# EAGLE schematic main1 (EAGLE 7.5.0)
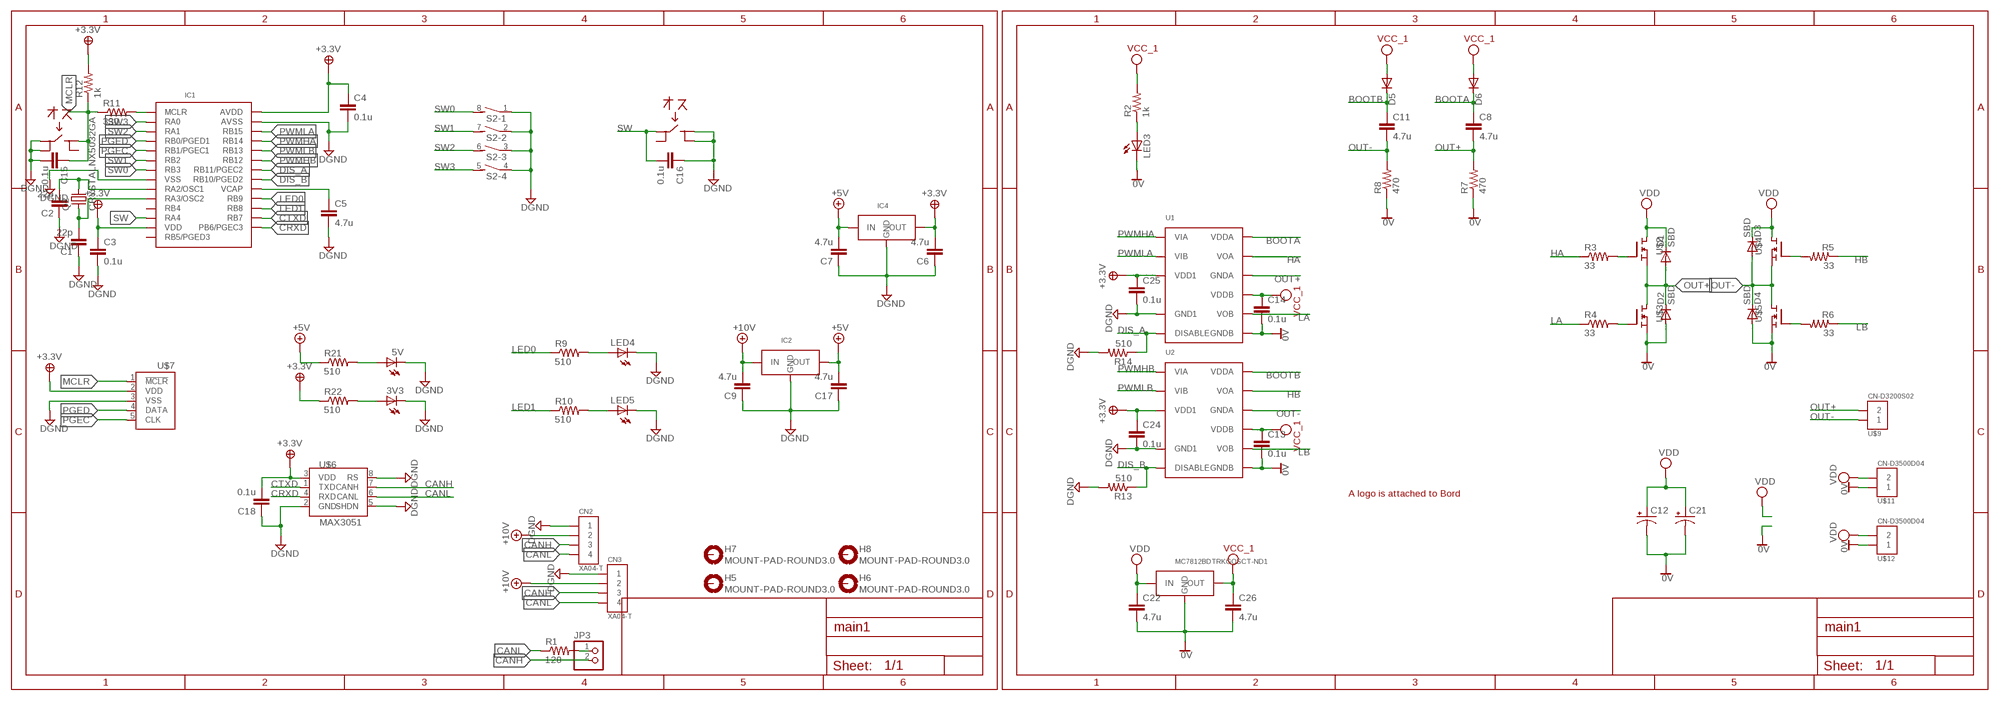
[diagram p0: schematic, sheet 1]

## Parts
3V3  LEDCHIPLED_0805  [CHIPLED_0805]
5V  LEDCHIPLED_0805  [CHIPLED_0805]
C1  22p  C-EUC0603K  [C0603K]
C2  22p  C-EUC0603K  [C0603K]
C3  0.1u  C-EUC0805K  [C0805K]
C4  0.1u  C-EUC0805K  [C0805K]
C5  4.7u  C-EUC0805K  [C0805K]
C6  4.7u  C-EUC0805K  [C0805K]
C7  4.7u  C-EUC0805K  [C0805K]
C8  4.7u  C-EUC0805K  [C0805K]
C9  4.7u  C-EUC0805K  [C0805K]
C11  4.7u  C-EUC0805K  [C0805K]
C12  CPOL-USG  [PANASONIC_G]
C13  0.1u  C-EUC0805K  [C0805K]
C14  0.1u  C-EUC0805K  [C0805K]
C15  0.1u  C-EUC0603K  [C0603K]
C16  0.1u  C-EUC0603K  [C0603K]
C17  4.7u  C-EUC0805K  [C0805K]
C18  0.1u  C-EUC0603K  [C0603K]
C21  CPOL-USG  [PANASONIC_G]
C22  4.7u  C-EUC0805K  [C0805K]
C24  0.1u  C-EUC0805K  [C0805K]
C25  0.1u  C-EUC0805K  [C0805K]
C26  4.7u  C-EUC0805K  [C0805K]
CN2  XA04-T  [XA04]
CN3  XA04-T  [XA04]
D1  SBD  DIODE-SOD106-R  [SOD106-R]
D2  SBD  DIODE-SOD106-R  [SOD106-R]
D3  SBD  DIODE-SOD106-R  [SOD106-R]
D4  SBD  DIODE-SOD106-R  [SOD106-R]
D5  DIODE-SOD106-R  [SOD106-R]
D6  DIODE-SOD106-R  [SOD106-R]
H5  MOUNT-PAD-ROUND3.0  [3,0-PAD]
H6  MOUNT-PAD-ROUND3.0  [3,0-PAD]
H7  MOUNT-PAD-ROUND3.0  [3,0-PAD]
H8  MOUNT-PAD-ROUND3.0  [3,0-PAD]
IC1  DSPIC33FJ32MC302/64MC202/64MC802/128MC202/128MC802  [SOIC28]
IC2  REGULATERNJM2845DL1  [TO-252-2]
IC4  REGULATERAZ1117CR  [SOT89]
JP3  PINHD-1X02_2.54  [1X02]
LED3  LEDCHIPLED_0805  [CHIPLED_0805]
LED4  LEDCHIPLED_0805  [CHIPLED_0805]
LED5  LEDCHIPLED_0805  [CHIPLED_0805]
MC7812BDTRKGOSCT-ND1  REGULATERMIC2940A-5.0WU  [TO-263-3]
Q2  CRYSTALNX5032GA  [NX5032GA]
R1  120  R-US_R0805  [R0805]
R2  1k  R-US_R0603  [R0603]
R3  33  R-US_R2512  [R2512]
R4  33  R-US_R2512  [R2512]
R5  33  R-US_R2512  [R2512]
R6  33  R-US_R2512  [R2512]
R7  470  R-US_R2512  [R2512]
R8  470  R-US_R2512  [R2512]
R9  510  R-US_R0603  [R0603]
R10  510  R-US_R0603  [R0603]
R11  330  R-US_R0603  [R0603]
R12  1k  R-US_R0603  [R0603]
R13  510  R-US_R0603  [R0603]
R14  510  R-US_R0603  [R0603]
R21  510  R-US_R0603  [R0603]
R22  510  R-US_R0603  [R0603]
S2  DIP04S  [DIP04S]
SW1  SWITCH_4PALPS  [SKRP]
SW2  SWITCH_4PALPS  [SKRP]
U1  ADUM3223_SMD  [SOIC16_N]
U2  ADUM3223_SMD  [SOIC16_N]
U$1  CN-D3500D04  [D-3500D04]
U$2  FET_NCHFDBL0065N40  [MO-299A]
U$3  FET_NCHFDBL0065N40  [MO-299A]
U$4  FET_NCHFDBL0065N40  [MO-299A]
U$5  FET_NCHFDBL0065N40  [MO-299A]
U$6  MAX3051  [SOIC8]
U$7  WRITE_FOR_PICT  [ZH05]
U$8  LOGOGOCHIUSA-14MM  [LOGO006]
U$9  CN-D3200S02  [D-3200S02-S]

## Nets
0V: C12.- C13.2 C14.2 C21.- C22.2 C26.2 D2.A D4.A LED3.C MC7812BDTRKGOSCT-ND1.2(GND) MC7812BDTRKGOSCT-ND1.4(GND) R7.1 R8.1 U1.P$9(GNDB) U2.P$9(GNDB) U$1.01A U$1.02A U$3.2(S) U$3.3(S) U$3.4(S) U$3.5(S) U$3.6(S) U$3.7(S) U$3.8(S) U$5.2(S) U$5.3(S) U$5.4(S) U$5.5(S) U$5.6(S) U$5.7(S) U$5.8(S)
3.3V: C3.1 C4.1 C6.2 C18.2 C24.1 C25.1 IC1.13(VDD) IC1.28(AVDD) IC4.2(OUT) IC4.P(OUT) R12.2 R22.1 U1.P$3(VDD1) U1.P$8(VDD1) U2.P$3(VDD1) U2.P$8(VDD1) U$6.3(VDD) U$7.2(VDD) ; supply symbol labelled +3.3V
+5V: C7.2 C17.2 IC2.3(OUT) IC4.3(IN) R21.1
+10V: C9.2 CN2.PIN2 CN3.PIN2 IC2.1(IN)
BOOTA: C8.1 D6.C U1.P$16(VDDA)
BOOTB: C11.1 D5.C U2.P$16(VDDA)
CANH: CN2.PIN3 CN3.PIN3 JP3.2 U$6.7(CANH)
CANL: CN2.PIN4 CN3.PIN4 R1.1 U$6.6(CANL)
CRXD: IC1.15(PB6/PGEC3) U$6.4(RXD)
CTXD: IC1.16(RB7) U$6.1(TXD)
DGND: 3V3.C 5V.C C1.1 C2.1 C3.2 C4.2 C5.2 C6.1 C7.1 C9.1 C15.2 C16.1 C17.1 C18.1 C24.2 C25.2 CN2.PIN1 CN3.PIN1 IC1.8(VSS) IC1.19(VSS) IC1.27(AVSS) IC2.2(GND) IC4.1(GND) LED4.C LED5.C R13.2 R14.2 S2.1 S2.2 S2.3 S2.4 SW1.1 SW1.2 SW2.3 SW2.4 U1.P$4(GND1) U2.P$4(GND1) U$6.2(GND) U$6.5(SHDN) U$6.8(RS) U$7.3(VSS)
DIS_A: IC1.22(RB11/PGEC2) R14.1 U1.P$5(DISABLE)
DIS_B: IC1.21(RB10/PGED2) R13.1 U2.P$5(DISABLE)
HA: R3.1 U1.P$15(VOA)
HB: R5.1 U2.P$15(VOA)
LA: R4.1 U1.P$10(VOB)
LB: R6.1 U2.P$10(VOB)
LED0: IC1.18(RB9) R9.1
LED1: IC1.17(RB8) R10.1
MCLR: C15.1 R11.1 R12.1 SW1.3 U$7.1(!MCLR)
N$1: C2.2 IC1.9(RA2/OSC1) Q2.2
N$2: C1.2 IC1.10(RA3/OSC2) Q2.1
N$3: C5.1 IC1.20(VCAP)
N$4: JP3.1 R1.2
N$5: LED3.A R2.1
N$6: LED4.A R9.2
N$7: LED5.A R10.2
N$8: R3.2 U$2.1(G)
N$9: R4.2 U$3.1(G)
N$13: R6.2 U$5.1(G)
N$15: R5.2 U$4.1(G)
N$17: IC1.1(MCLR) R11.2
N$21: 5V.A R21.2
N$22: 3V3.A R22.2
OUT+: C8.2 D1.A D2.C R7.2 U1.P$14(GNDA) U$2.2(S) U$2.3(S) U$2.4(S) U$2.5(S) U$2.6(S) U$2.7(S) U$2.8(S) U$3.PAD1(D) U$3.PAD2(D) U$3.PAD3(D) U$3.PAD4(D) U$9.2 U$9.P$2
OUT-: C11.2 D3.A D4.C R8.2 U2.P$14(GNDA) U$4.2(S) U$4.3(S) U$4.4(S) U$4.5(S) U$4.6(S) U$4.7(S) U$4.8(S) U$5.PAD1(D) U$5.PAD2(D) U$5.PAD3(D) U$5.PAD4(D) U$9.1 U$9.P$1
PGEC: IC1.5(RB1/PGEC1) U$7.5(CLK)
PGED: IC1.4(RB0/PGED1) U$7.4(DATA)
PWMHA: IC1.25(RB14) U1.P$1(VIA)
PWMHB: IC1.23(RB12) U2.P$1(VIA)
PWMLA: IC1.26(RB15) U1.P$2(VIB)
PWMLB: IC1.24(RB13) U2.P$2(VIB)
SW: C16.2 IC1.12(RA4) SW2.1
SW0: IC1.7(RB3) S2.8
SW1: IC1.6(RB2) S2.7
SW2: IC1.3(RA1) S2.6
SW3: IC1.2(RA0) S2.5
VCC_1: C13.1 C14.1 C26.1 D5.A D6.A MC7812BDTRKGOSCT-ND1.3(OUT) R2.2 U1.P$11(VDDB) U2.P$11(VDDB)
VDD: C12.+ C21.+ C22.1 D1.C D3.C MC7812BDTRKGOSCT-ND1.1(IN) U$1.01B U$1.02B U$2.PAD1(D) U$2.PAD2(D) U$2.PAD3(D) U$2.PAD4(D) U$4.PAD1(D) U$4.PAD2(D) U$4.PAD3(D) U$4.PAD4(D)
Unconnected: H5.B3,0(MOUNT) H6.B3,0(MOUNT) H7.B3,0(MOUNT) H8.B3,0(MOUNT) IC1.11(RB4) IC1.14(RB5/PGED3) SW1.4 SW2.2

## Library data of the parts
3V3 5V LED3-LED5 = led:LED: LED OSRAM: - CHIPLED LG R971, LG N971, LY N971, LG Q971, LY Q971, LO R971, LY R971 LH N974, LH R974 LS Q976, LO Q976, LY Q976 LO Q996 - Hyper CHIPLED LW Q18S LB Q993, LB Q99A, LB R99A - SideLED LS A670, LO A670, LY A670, LG A670, LP A670 LB A673, LV A673, LT A673, LW A673 LH A674 LY A675 LS A676, LA A676, LO A676, LY A676, LW A676 LS A679, LY A679, LG A679 - Hyper Micro SIDELED® LS Y876, LA Y876, LO Y876, LY Y876 LT Y87S - SmartLED LW L88C, LW L88S LB L89C, LB L89S, LG L890 LS L89K, LO L89K, LY L89K LS L896, LA L896, LO L896, LY L896 - TOPLED LS T670, LO T670, LY T670, LG T670, LP T670 LSG T670, LSP T670, LSY T670, LOP T670, LYG T670 LG T671, LOG T671, LSG T671 LB T673, LV T673, LT T673, LW T673 LH T674 LS T676, LA T676, LO T676, LY T676, LB T676, LH T676, LSB T676, LW T676 LB T67C, LV T67C, LT T67C, LS T67K, LO T67K, LY T67K, LW E67C LS E67B, LA E67B, LO E67B, LY E67B, LB E67C, LV E67C, LT E67C LW T67C LS T679, LY T679, LG T679 LS T770, LO T770, LY T770, LG T770, LP T770 LB T773, LV T773, LT T773, LW T773 LH T774 LS E675, LA E675, LY E675, LS T675 LS T776, LA T776, LO T776, LY T776, LB T776 LHGB T686 LT T68C, LB T68C - Hyper Mini TOPLED® LB M676 - Mini TOPLED Santana® LG M470 LS M47K, LO M47K, LY M47K Source: http://www.osram.convergy.de LUXEON: - LUMILED® LXK2-PW12-R00, LXK2-PW12-S00, LXK2-PW14-U00, LXK2-PW14-V00 LXK2-PM12-R00, LXK2-PM12-S00, LXK2-PM14-U00 LXK2-PE12-Q00, LXK2-PE12-R00, LXK2-PE12-S00, LXK2-PE14-T00, LXK2-PE14-U00 LXK2-PB12-K00, LXK2-PB12-L00, LXK2-PB12-M00, LXK2-PB14-N00, LXK2-PB14-P00, LXK2-PB14-Q00 LXK2-PR12-L00, LXK2-PR12-M00, LXK2-PR14-Q00, LXK2-PR14-R00 LXK2-PD12-Q00, LXK2-PD12-R00, LXK2-PD12-S00 LXK2-PH12-R00, LXK2-PH12-S00 LXK2-PL12-P00, LXK2-PL12-Q00, LXK2-PL12-R00 Source: www.luxeon.com KINGBRIGHT: KA-3528ASYC Source: www.kingbright.com
C1-C9 C11 C13-C18 C22 C24-C26 = rp_c:C-EU: CAPACITOR, European symbol
C12 C21 = rcl:CPOL-US: POLARIZED CAPACITOR, American symbol
CN2 CN3 = rp_cn_xa:XA04
D1-D6 = diode:DIODE-: DIODE
H5-H8 = holes:MOUNT-PAD-ROUND: MOUNTING PAD, round
IC1 = Syohei:DSPIC33FJ32MC302/64MC202/64MC802/128MC202/128MC802
IC2 IC4 MC7812BDTRKGOSCT-ND1 = Syohei:REGULATER
JP3 = pinhead-2:PINHD-1X02: PIN HEADER
Q2 = Syohei:CRYSTAL
R1-R14 R21 R22 = rp_r:R-US_: RESISTOR, American symbol
S2 = switch-dil:DIP04S: DIL/CODE SWITCH; OC_FARNELL: unknown; OC_NEWARK: unknown
SW1 SW2 = Syohei:SWITCH_4P
U1 U2 = IC_module:ADUM3223
U$1 = Syohei:CN-D3500D04
U$2-U$5 = Syohei:FET_NCH
U$6 = Syohei:MAX3051
U$7 = Syohei:WRITE_FOR_PIC
U$8 = Syohei:LOGO
U$9 = Syohei:CN-D3200S02